# Altium schematic sheet subckt_analog_supplies.SchDoc
size B; SheetNumber: 3; SheetTotal: 4
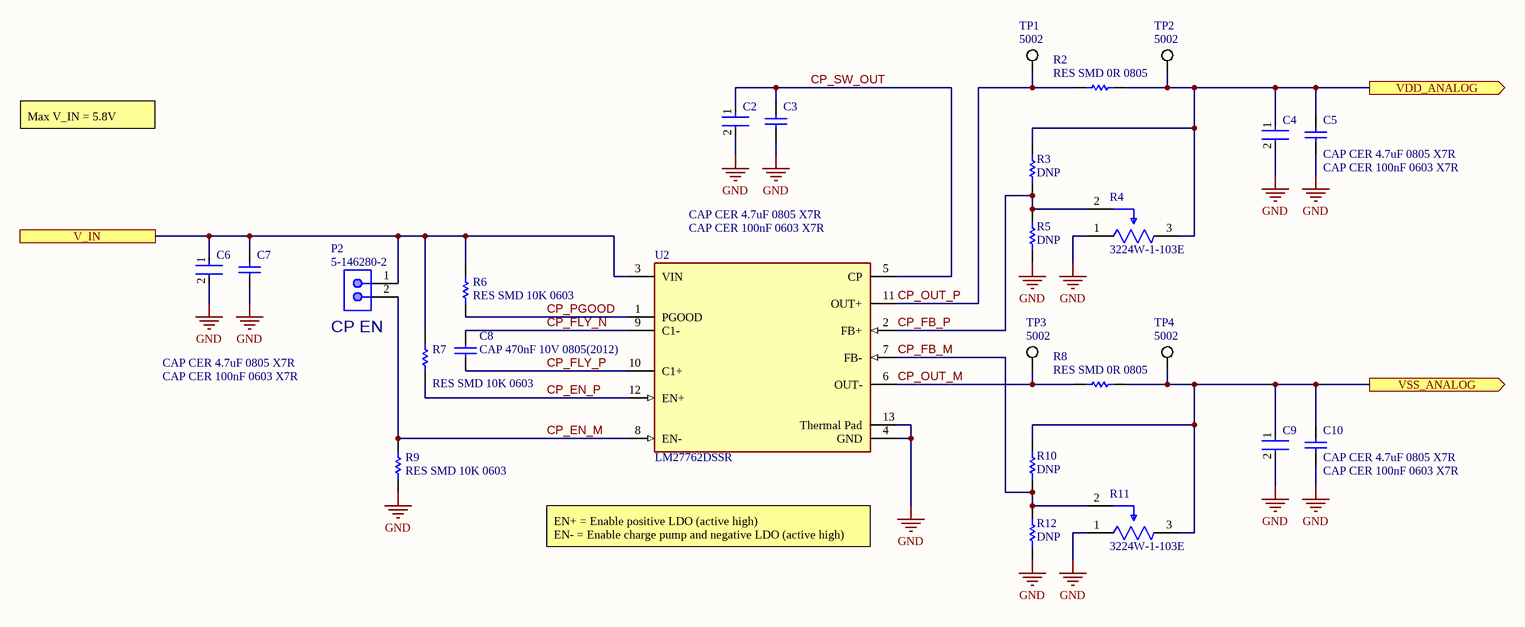
[diagram p0: subckt_analog_supplies.SchDoc]

## Parts
C2  CAP CER 100nF 0603 X7R  [FP-CC0603-DA-MFG]
C3  CAP CER 4.7uF 0805 X7R  [CAPC2013X140X50NL20T25]
C4  CAP CER 100nF 0603 X7R  [FP-CC0603-DA-MFG]
C5  CAP CER 4.7uF 0805 X7R  [CAPC2013X140X50NL20T25]
C6  CAP CER 100nF 0603 X7R  [FP-CC0603-DA-MFG]
C7  CAP CER 4.7uF 0805 X7R  [CAPC2013X140X50NL20T25]
C8  CAP 470nF 10V 0805(2012)  [CAPC0805(2012)145_M]
C9  CAP CER 100nF 0603 X7R  [FP-CC0603-DA-MFG]
C10  CAP CER 4.7uF 0805 X7R  [CAPC2013X140X50NL20T25]
P2  5-146280-2  [TECO-5-146280-2_V]
R2  RES SMD 0R 0805  [RESC2013X55X40NL15T20]
R3  DNP  [RESC1608X55X30LL10T20_A]
R4  3224W-1-103E  [FP-3224W-MFG]
R5  DNP  [RESC1608X55X30LL10T20_A]
R6  RES SMD 10K 0603  [RESC1609X55X30LL15T15]
R7  RES SMD 10K 0603  [RESC1609X55X30LL15T15]
R8  RES SMD 0R 0805  [RESC2013X55X40NL15T20]
R9  RES SMD 10K 0603  [RESC1609X55X30LL15T15]
R10  DNP  [RESC1608X55X30LL10T20_A]
R11  3224W-1-103E  [FP-3224W-MFG]
R12  DNP  [RESC1608X55X30LL10T20_A]
TP1  5002  [KSTN-5002]
TP2  5002  [KSTN-5002]
TP3  5002  [KSTN-5002]
TP4  5002  [KSTN-5002]
U2  LM27762DSSR  [FP-DSS0012B-MFG]

## Ports
V_IN, VDD_ANALOG (out), VSS_ANALOG (out)

## Nets
GND: C2.2 C3.2 C4.2 C5.2 C6.2 C7.2 C9.2 C10.2 R4.1(CCW) R5.1 R9.1 R11.1(CCW) R12.1 U2.4(GND) U2.13(Thermal_Pad)
CP_EN_M: P2.2 R9.2 U2.8(EN-)
CP_EN_P: R7.1 U2.12(EN+)
CP_FB_M: R10.1 R11.2(WIPER) R12.2 U2.7(FB-)
CP_FB_P: R3.1 R4.2(WIPER) R5.2 U2.2(FB+)
CP_FLY_N: C8.2 U2.9(C1-)
CP_FLY_P: C8.1 U2.10(C1+)
CP_OUT_M: R8.1 TP3.1 U2.6(OUT-)
CP_OUT_P: R2.1 TP1.1 U2.11(OUT+)
CP_PGOOD: R6.1 U2.1(PGOOD)
CP_SW_OUT: C2.1 C3.1 U2.5(CP)
V_IN: C6.1 C7.1 P2.1 R6.2 R7.2 U2.3(VIN) ; port V_IN
VDD_ANALOG: C4.1 C5.1 R2.2 R3.2 R4.3(CW) TP2.1 ; port VDD_ANALOG
VSS_ANALOG: C9.1 C10.1 R8.2 R10.2 R11.3(CW) TP4.1 ; port VSS_ANALOG

## Notes on the sheet
- Max V_IN = 5.8V
- (near P2) CP EN
- EN+ = Enable positive LDO (active high)
  EN- = Enable charge pump and negative LDO (active high)

## Library data of the parts
C2 C4 C6 C9 = CMP-03422-000030-1: CAP CER 0.1UF 16V X7R 0603; Manufacturer Part Number: CC0603KRX7R7BB104; Manufacturer: YAGEO; Tolerance: 0.1; Temperature Coefficient: 15%; Material: Ceramic; Voltage Rating: 16 V; Package: CC0603-DA; ComponentLink2Description: Datasheet; Octopart: https://octopart.com/cc0603krx7r7bb104-yageo-192941; Temperature Range High: +125°C; Digikey Description: CAP CER 0.1UF 16V X7R 0603; Value: 100 nF; Voltage: 16 V; Device Class L2: Capacitors; Height: 0.9mm; Temperature: -55°C to +125°C; Device Class L1: Passive Components; Device Class L3: Ceramic Capacitors; ComponentLink2URL: http://www.yageo.com/documents/recent/UPY-GPHC_X7R_6.3V-to-50V_18.pdf; Footprint Url: http://www.yageo.com/exep/pages/download/literatures/UPY-C_GEN_24.pdf; RoHS: TRUE; Temperature Range Low: -55°C; Temperature Characteristic: X7R; Lead Free: Yes; Capacitance: 100 nF; Category: Cap; Mouser Description: Multilayer Ceramic Capacitor, CC Series, 0.1 - F, - 10%, X7R, 16 V, 0603 [1608 Metric]; Automotive: No
C3 C5 C7 C10 = CMP-2007-04677-1: Part Number: 0805ZC475KAT2A; Manufacturer: AVX Interconnect / Elco
C8 = CMP-1036-04629-1: CAP 470nF 10V ±5% 0805 (2012 Metric) Thickness 1.45mm SMD; Case-EIA: 0805; Case-Metric: 2012; Tolerance: Â±5%; Max Thickness: 1.45 mm; Rated Voltage: 10 V; Technology: SMT; Value: 470nF
P2 = CMP-2000-07492-1: Male Header, Pitch 2.54 mm, 1 x 2 Position, Height 8.21 mm, Tail Length 3.05 mm, -65 to 105 degC, RoHS, Bulk; Manufacturer: TE Connectivity; Mating Connector Lock: No(Without); Number of Positions: 2; Pitch: 2.54mm; PCB Mounting Orientation: Vertical; Keyed: No; Case\/Package: 100; Mating Post Length: 0.23inch; High Temperature Housing: Yes; Max Current Rating: 5A; PCB Thickness: 0.063inch; PCB Mount Retention: Without; Approvals: CSA; Current Rating: 3A; Radiation Hardening: No; Length: 4.67mm; Contact Mating Length: 0.23inch; Connector Type: Header; Number of Rows: 1; Termination Post Length: 0.12inch; Board Standoff: No(Without); Max Operating Temperature: 105degC; Contact Shape: Square; Selectively Loaded: No(Without); Gasket: No(Without); Number of Contacts: 2; Contact Gender: Male; Mating Alignment: No(Without); Manufacturer URL: http://www.te.com/; Datasheet URL: http://www.te.com/commerce/DocumentDelivery/DDEController?Action=showdoc&DocId=Customer+Drawing%7F146280%7FH1%7Fpdf%7FEnglish%7FENG_CD_146280_H1.pdf%7F5-146280-2; Mount: ThroughHole; Orientation: Straight; Packaging: Carton; Package Reference: 5-146280-2; Package Quantity: 500; Stabilizers: No(Without); Row Spacing: 2.54mm; Contact Material: CopperAlloy; Panel Mount Retention: No(Without); Datasheet Version: Rev. H1, 08/2016; Housing Colour: Black; Colour: Black; Package Description: Male Header, Pitch 2.54 mm, 1 x 2 Position, Height 8.21 mm, Tail Length 3.05 mm; Contact Plating: Matte; Housing Material: Polymer; Contact Protection: No(Without); Min Operating Temperature: -65degC; Mounting Technology: ThroughHole; Flammability Rating: UL94V-0; RoHSCompliant: true; Termination: ThroughHole; Depth: 2.34mm; High Speed Serial Data Connector: No
R2 R8 = CMP-2001-04723-1: Manufacturer: Vishay Dale; Part Number: TNPW0805100RBEEA
R3 R5 R10 R12 = CMP-2000-06686-1: Chip Resistor, 0 Ohm, +/- 5%, 100 mW, -55 to 155 degC, 0603 (1608 Metric), RoHS, Tape and Reel; Manufacturer: Rohm; Tolerance: Jumper; Power (Watts): 0.1W,1/10W; Resistance (Ohms): 0.0; Online Catalog: MCR03Series; EDA / CAD Models: DownloadfromAcceleratedDesigns; Other Names: RHM0.0CGTR; Series: MCR; Package Description: 2-Pin Surface Mount Device, Body 1.60 x 0.80 mm; Composition: ThickFilm; Height: 0.022"(0.55mm); Mounting Technology: SurfaceMount; Family: ChipResistor-SurfaceMount; Temperature Coefficient: -; Category: Resistors; Supplier Device Package: 0603(1608Metric); Package Reference: 0603; Size / Dimension: 0.063"Lx0.031"W(1.60mmx0.80mm); Standard Package: 5,000; Datasheet URL: http://www.rohm.com/web/global/datasheet/MCR03ERTJ; Features: -; Datasheet Version: Rev. F, 02/2015; Operating Temperature: -55°C~155°C; Package / Case: 0603(1608Metric); Manufacturer URL: http://www.rohm.com/web/global/; Packaging: Tape&Reel(TR); Number of Terminations: 2
R4 R11 = CMP-07234-000002-1: TRIMMER 10K OHM 0.25W J LEAD TOP; Manufacturer: Bourns; Tolerance: 10%; Resistance: 10kΩ; Temperature Coefficient: 100ppm/°C; Value: 10kΩ; Standoff Height: 0.2mm; Voltage Rating: 300V; Power Rating: 250mW; Device Class L3: Variable Resistors and Potentiometers; Composition: Cermet; Temperature Range Low: -65°C; Package: 3224W; ComponentLink2Description: Datasheet; Digikey Description: TRIMMER 10K OHM 0.25W J LEAD TOP; Category: Res; Mouser Description: Trimmer Resistors - SMD 4mm 10Kohms 10% Square Cermet Sealed; Temperature: -65°C to +150°C; Device Class L2: Resistors; Device Class L1: Passive Components; RoHS: TRUE; Temperature Range High: +150°C; Manufacturer Part Number: 3224W-1-103E; ComponentLink2URL: https://upverter.com/datasheet/a166fca85da25564670351d2dc712345c058bc40.pdf; Series: 3224; Height: 5.55mm; Lead Free: Yes; Octopart: https://octopart.com/3224w-1-103e-bourns-14818; Automotive: No
R6 R7 R9 = CMP-2000-07452-1: Chip Resistor, 10 KOhm, +/- 1%, 0.1 W, -55 to 155 degC, 0603 (1608 Metric), RoHS, Tape and Reel; Manufacturer: Panasonic; Voltage Rating: 75V; Case\/Package: 0603; Power Rating: 100mW; Resistance: 10KOhm; Temperature Coefficient: 100ppm\/degreesC; Number of Pins: 2; Package Reference: 603; Depth: 0.8mm; Mount: SurfaceMount; Package Description: 2-Pin Surface Mount Device, Body 1.6 x 0.85 mm; Datasheet Version: 02/2017; Length: 1.6mm; Lead Free: LeadFree; Height: 0.45mm; Number of Terminations: 2; Max Power Dissipation: 100mW; Min Operating Temperature: -55degC; Datasheet URL: https://industrial.panasonic.com/cdbs/www-data/pdf/RDA0000/AOA0000C304.pdf; Termination: SMD/SMT; Case Code (Metric): 1608; Case Code (Imperial): 0603; Tolerance: 1%; Max Operating Temperature: 155degC; RoHSCompliant: true; Voltage Rating (DC): 75V; Radiation Hardening: No; Packaging: TapeandReel; Composition: ThickFilm; Mounting Technology: SurfaceMount; Manufacturer URL: http://www.panasonic.com/; Width: 0.031inch; REACH SVHC: NoSVHC; Contact Plating: Tin; Military Standard: Not; Package Quantity: 1
TP1-TP4 = CMP-2000-05182-1: Test Point, White, 1-Pin THD, RoHS, Bulk; Manufacturer: KeystoneElectronics; Outside Diameter: 2.54mm; Plating: Silver; Mounting Hole Size: 1mm; Product: TestPoints; Packaging: Bulk; Manufacturer URL: http://www.keyelco.com/; Length: 7.62mm; Datasheet Version: Rev. G, 12/2008; Type: Miniature; Product Category: CircuitBoardHardware-PCB; Material: Nylon; RoHS: True; Contact Material: PhosphorBronze; Datasheet URL: https://ciiva.com/datasheet-click-2917627?src=ciiva&sig=bd195616; Color: White; Brand: KeystoneElectronics
U2 = CMP-04918-000139-1: IC REG CHARGE PUMP ADJ DL 12WSON; Switching Frequency: 2.3MHz; Output Current: 250mA; Output Type: Adjustable; Min Output Voltage: 1.5V; Min Input Voltage: 2.7V; Synchronous Rectifier: No; Quiescent Current: 390uA; Max Input Voltage: 5.5V; Max Output Voltage: 5V; Mount: Surface Mount; Lead Free: Lead Free; Topology: Charge Pump; Max Operating Temperature: 85°C; Min Operating Temperature: -40°C; Packaging: Tape and Reel